# Altium schematic sheet power.SchDoc: Power Supply
size A4; DrawnBy: Juan I Carrano; DocumentNumber: 2; SheetNumber: 2; SheetTotal: 6
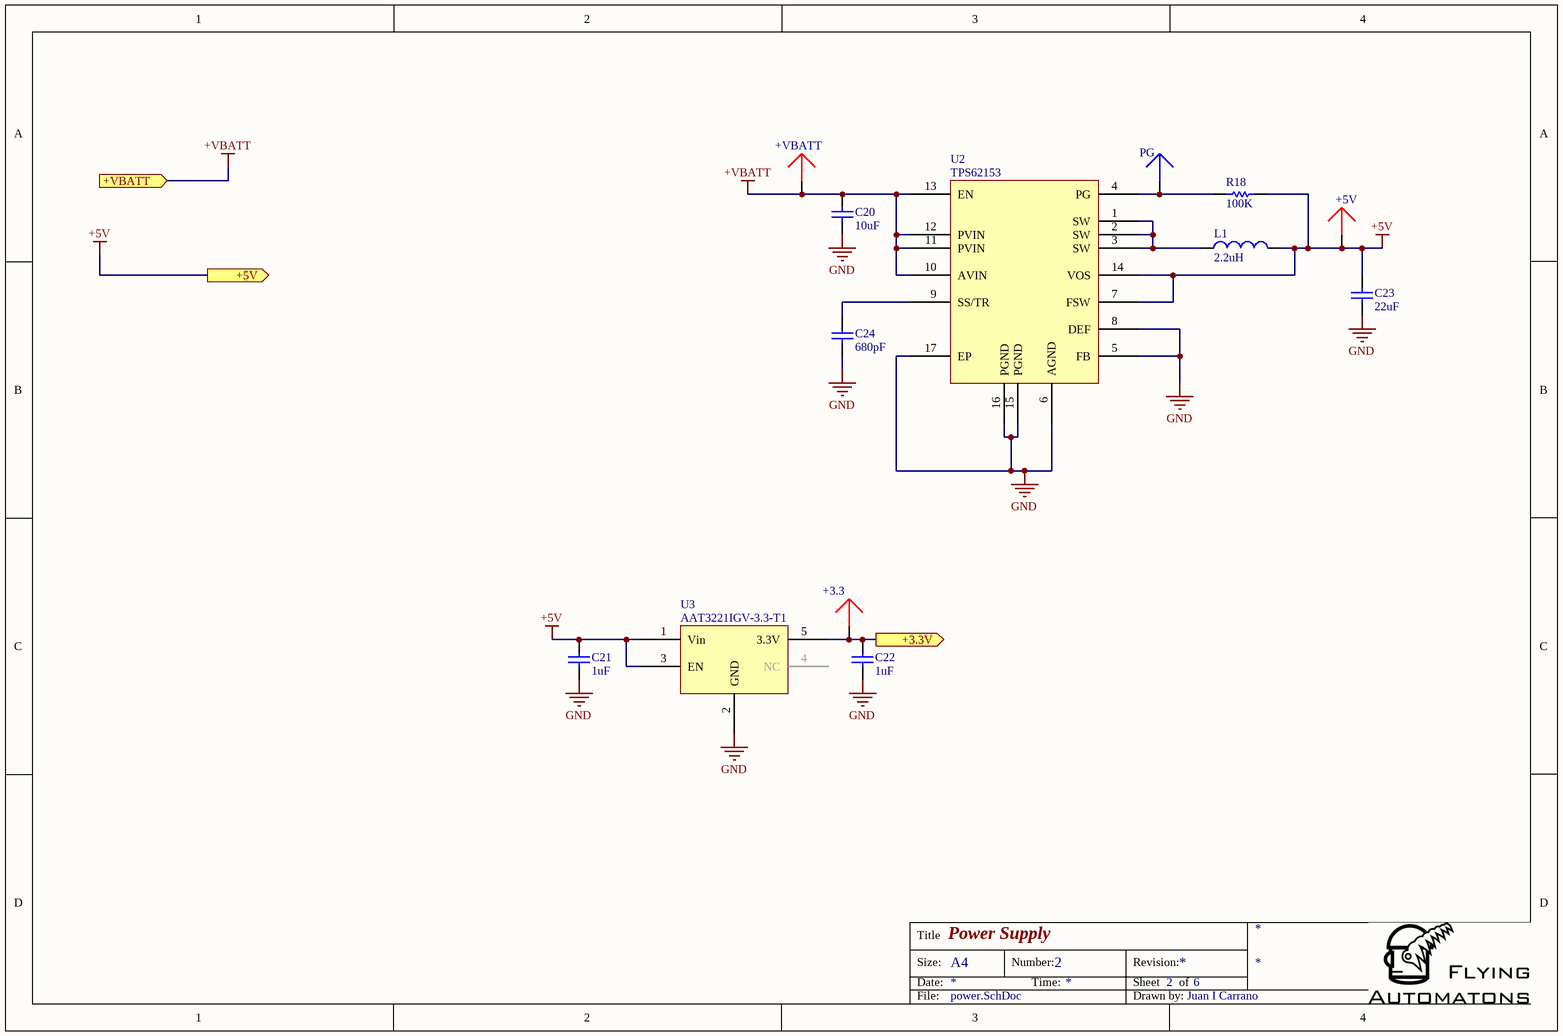
[diagram p0: power.SchDoc]

## Parts
+3.3  TESTPOINT-ARROW-RED  [G-PIN_1mm-CIRCLE]  (value not drawn)
+5V  TESTPOINT-ARROW-RED  [G-PIN_1mm-CIRCLE]  (value not drawn)
+VBATT  TESTPOINT-ARROW-RED  [G-PIN_1mm-CIRCLE]  (value not drawn)
C20  10uF  [CAPC3216L]
C21  1uF  [CAPC1608L]
C22  1uF  [CAPC1608L]
C23  22uF  [CAPC3216L]
C24  680pF  [CAPC1608L]
L1  2.2uH  [X-TDK_FLF3215]
PG  TESTPOINT-ARROW-BLUE  [G-PIN_1mm-CIRCLE]  (value not drawn)
R18  100K  [RESC1608L]
U2  Manufacturer Part Number: TPS62153  [JEDEC_MO-220VEED-4]  (hidden comment: TPS6215x)
U3  Manufacturer Part Number: AAT3221IGV-3.3-T1  [JEDEC_MO-178AA]  (hidden comment: LREG_3T_5pinA_EN_3.3V)

## Ports
+3.3V (out), +5V (out), +VBATT (in)

## Nets
+5V: +5V.1 C21.1 C23.1 L1.2 R18.1 U2.7(FSW) U2.14(VOS) U3.1(Vin) U3.3(EN) ; port +5V
+VBATT: +VBATT.1 C20.1 U2.10(AVIN) U2.11(PVIN) U2.12(PVIN) U2.13(EN) ; port +VBATT
GND: C20.2 C21.2 C22.2 C23.2 C24.2 U2.5(FB) U2.6(AGND) U2.8(DEF) U2.15(PGND) U2.16(PGND) U2.17(EP) U3.2(GND)
+3.3V: +3.3.1 C22.1 U3.5(3.3V) ; port +3.3V
NetC24_1: C24.1 U2.9(SS/TR)
NetL1_1: L1.1 U2.1(SW) U2.2(SW) U2.3(SW)
NetPG_1: PG.1 R18.2 U2.4(PG)

Not connected (* = marked no-connect by the designer): U3 4(NC)

## Notes on the sheet
- Title
- Size:
- Date:
- A4
- Number:
- Time:
- Revision:
- Sheet
- of
- File:
- Drawn by:

## Library data of the parts
+3.3 +5V +VBATT = TESTP_PWR_1mm: Tespoint for Power Trace; Name: TESTP_PWR_1mm
C20 = CAP_10u_1206_25V_Y5V: CAP CER 10UF 25V Y5V 1206; Manufacturer Part Number: TMK316F106ZL-T; Name: CAP_10u_1206_25V_Y5V; Value: 10uF; Supplier 1: Digi-Key; Supplier Part Number 1: 587-1353-1-ND
C21 C22 = CAP_1u_0603_25V_X5R_10%: CAP CER 1UF 25V 10% X5R 0603; Manufacturer Part Number: TMK107BJ105KA-T; Name: CAP_1u_0603_25V_X5R_10%; Value: 1uF; Supplier 1: Digi-Key; Supplier Part Number 1: 587-1248-1-ND
C23 = CAP_22u_1206_16V_X5R_10%: CAP CER 22UF 16V 10% X5R 1206; Manufacturer: Samsung Electro-Mechanics America, Inc; Manufacturer Part Number: CL31A226KOCLFNC; Name: CAP_22u_1206_16V_X5R_10%; Value: 22uF; Supplier 1: Digi-Key; Supplier Part Number 1: 1276-2725-1-ND
C24 = CAP_680p_0603_50V_NP0_5%: CAP CER 680PF 50V 5% NP0 0603; Manufacturer: Samsung Electro-Mechanics America, Inc; Manufacturer Part Number: CL10C681JB8NFNC; Name: CAP_680p_0603_50V_NP0_5%; Value: 680pF; Supplier 1: Digi-Key; Supplier Part Number 1: 1276-2329-1-ND
L1 = IND_2u2_SMD_1A4_20%_3.2x2.5: INDUCTOR 2.2UH 1.4A 20% SMD; Manufacturer: TDK Corporation; Manufacturer Part Number: FLF3215T-2R2M; Name: IND_2u2_SMD_1A4_20%_3.2x2.5; Value: 2.2uH; Supplier 1: Digi-Key; Supplier Part Number 1: 445-4845-6-ND
PG = TESTP_SIG_1mm: Tespoint; Name: TESTP_SIG_1mm
R18 = RES_100K_0603_0W1_1%: RES 100K OHM 1/10W 1% 0603 SMD; Manufacturer: Rohm Semiconductor; Manufacturer Part Number: MCR03ERTF1003; Name: RES_100K_0603_0W1_1%; Value: 100K; Supplier 1: Digi-Key; Supplier Part Number 1: RHM100KCFCT-ND
U2 = x-TI_TPS62153: 3-17V 1A Step-Down Converter in 3x3 QFN Package; Manufacturer: Texas Instruments; Value: 1A, 5V,  1.25MHz; Drawn By: Juan I Carrano; Name: x-TI_TPS62153; Supplier 1: Texas Instruments
U3 = g-LREG_3V3_0A15_EN_SOT753: 150 mA LDO Linear Regulator, SOT23-5; Manufacturer: Skyworks Solutions Inc; Value: 3.3V, 0.15A; Name: g-LREG_3V3_0A15_EN_SOT753; Supplier 1: Digi-Key; Supplier Part Number 1: 863-1491-1-ND